# EAGLE design 8Pin_Fuse (EAGLE 9.6.2)
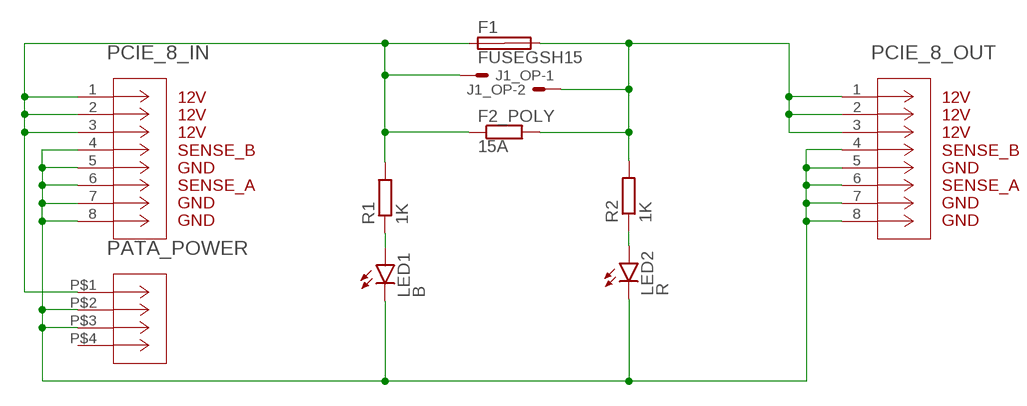
[diagram p0: schematic, sheet 1]

## Parts
F1  FUSEGSH15  SHK20Q  [SHK20Q]
F2_POLY  15A  R-EU_M1206  [M1206]
J1_OP  87758-0216  [87758-0216]
LED1  B  LEDSML0805  [SML0805]
LED2  R  LEDSML0805  [SML0805]
PATA_POWER  PATA_POWER  [PATA_POWER]
PCIE_8_IN  457180003A  [CON_457180003_MOL]
PCIE_8_OUT  457180003A  [CON_457180003_MOL]
R1  1K  R-EU_M0805  [M0805]
R2  1K  R-EU_M0805  [M0805]

## Nets
12V: F1.1A F2_POLY.1 J1_OP.1 PATA_POWER.P$1 PCIE_8_IN.1 PCIE_8_IN.2 PCIE_8_IN.3 R1.2
12VO [12V]: F1.2A F2_POLY.2 J1_OP.2 PCIE_8_OUT.1 PCIE_8_OUT.2 PCIE_8_OUT.3 R2.2
GND: LED1.C LED2.C PATA_POWER.P$2 PATA_POWER.P$3 PCIE_8_IN.4 PCIE_8_IN.5 PCIE_8_IN.6 PCIE_8_IN.7 PCIE_8_IN.8 PCIE_8_OUT.4 PCIE_8_OUT.5 PCIE_8_OUT.6 PCIE_8_OUT.7 PCIE_8_OUT.8
N$4 [12V]: LED2.A R2.1
N$5 [12V]: LED1.A R1.1
Unconnected: F1.1B F1.2B PATA_POWER.P$4

## Library data of the parts
F1 = fuse:SHK20Q: FUSE HOLDER 5 x 20 mm, SH contact, E1207 Buerklin 64G6061; OC_FARNELL: unknown; OC_NEWARK: unknown
F2_POLY R1 R2 = rcl:R-EU_: RESISTOR, European symbol; SPICEPREFIX: R
J1_OP = con-molex:87758-0216: 2 Pin - 2mm Dual Row Single Wafer, Vertical T/H HDR Source: http://www.molex.com/pdm_docs/sd/877580616_sd.pdf; MF: MOLEX; MPN: 87758-0216; OC_FARNELL: unknown; OC_NEWARK: 94M1513
LED1 LED2 = led:LED: LED OSRAM: - CHIPLED LG R971, LG N971, LY N971, LG Q971, LY Q971, LO R971, LY R971 LH N974, LH R974 LS Q976, LO Q976, LY Q976 LO Q996 - Hyper CHIPLED LW Q18S LB Q993, LB Q99A, LB R99A - SideLED LS A670, LO A670, LY A670, LG A670, LP A670 LB A673, LV A673, LT A673, LW A673 LH A674 LY A675 LS A676, LA A676, LO A676, LY A676, LW A676 LS A679, LY A679, LG A679 - Hyper Micro SIDELED® LS Y876, LA Y876, LO Y876, LY Y876 LT Y87S - SmartLED LW L88C, LW L88S LB L89C, LB L89S, LG L890 LS L89K, LO L89K, LY L89K LS L896, LA L896, LO L896, LY L896 - TOPLED LS T670, LO T670, LY T670, LG T670, LP T670 LSG T670, LSP T670, LSY T670, LOP T670, LYG T670 LG T671, LOG T671, LSG T671 LB T673, LV T673, LT T673, LW T673 LH T674 LS T676, LA T676, LO T676, LY T676, LB T676, LH T676, LSB T676, LW T676 LB T67C, LV T67C, LT T67C, LS T67K, LO T67K, LY T67K, LW E67C LS E67B, LA E67B, LO E67B, LY E67B, LB E67C, LV E67C, LT E67C LW T67C LS T679, LY T679, LG T679 LS T770, LO T770, LY T770, LG T770, LP T770 LB T773, LV T773, LT T773, LW T773 LH T774 LS E675, LA E675, LY E675, LS T675 LS T776, LA T776, LO T776, LY T776, LB T776 LHGB T686 LT T68C, LB T68C - Hyper Mini TOPLED® LB M676 - Mini TOPLED Santana® LG M470 LS M47K, LO M47K, LY M47K Source: http://www.osram.convergy.de LUXEON: - LUMILED® LXK2-PW12-R00, LXK2-PW12-S00, LXK2-PW14-U00, LXK2-PW14-V00 LXK2-PM12-R00, LXK2-PM12-S00, LXK2-PM14-U00 LXK2-PE12-Q00, LXK2-PE12-R00, LXK2-PE12-S00, LXK2-PE14-T00, LXK2-PE14-U00 LXK2-PB12-K00, LXK2-PB12-L00, LXK2-PB12-M00, LXK2-PB14-N00, LXK2-PB14-P00, LXK2-PB14-Q00 LXK2-PR12-L00, LXK2-PR12-M00, LXK2-PR14-Q00, LXK2-PR14-R00 LXK2-PD12-Q00, LXK2-PD12-R00, LXK2-PD12-S00 LXK2-PH12-R00, LXK2-PH12-S00 LXK2-PL12-P00, LXK2-PL12-Q00, LXK2-PL12-R00 Source: www.luxeon.com KINGBRIGHT: KA-3528ASYC Source: www.kingbright.com
PATA_POWER = PCIE_6_8Pin:PATA_POWER
PCIE_8_IN PCIE_8_OUT = PCIE_6_8Pin:457180003

## Net classes
2 GND: clearance 0.508 mm

## Board
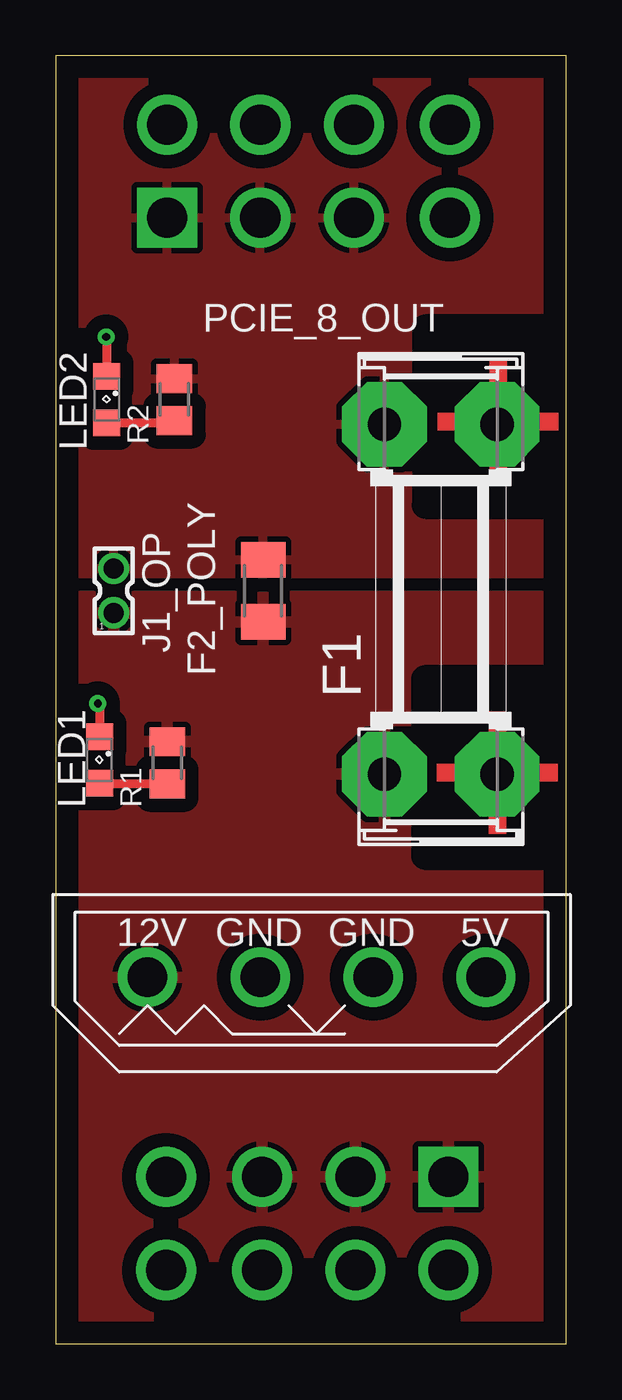
[diagram p1: board, top side]
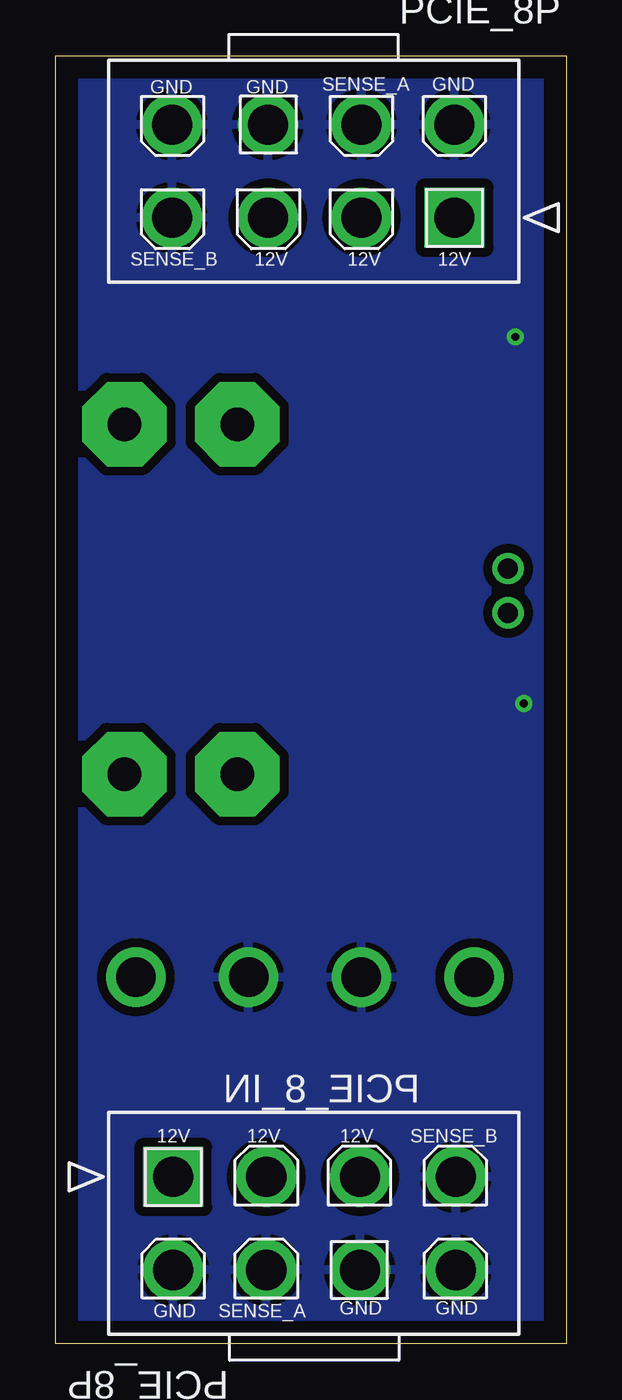
[diagram p2: board, bottom side, seen from below]

Size 23 x 58 mm. Coordinates in mm from the lower left corner, seen from the top.
Outline: 0,0 23,0 23,58 0,58 0,0
Copper layers (1*16): Top 0.035mm / dielectric 1.5mm / Bottom 0.035mm
Design rules "default": minimum track width 6mil, minimum drill 0.35mm, track to track 6mil, track to pad 6mil, pad to pad 6mil, via to via 6mil, smd to smd 6mil, copper to edge 40mil, drill to drill 6mil, minimum pad ring 10mil, minimum via ring 8mil, stop-mask expansion 4mil, vias tented up to drill 0mil, thermal gap 10mil

### Footprints (pad centres in the part's own frame; a part is rotated, then mirrored left to right if it is on the bottom)
SHK20Q = drill 1.5 pad 3.81 octagon: 1A -7.874,2.54; 1B -7.874,-2.54; 2A 7.874,2.54; 2B 7.874,-2.54
M1206 = smd 1.6 x 2: 1 -1.4,0; 2 1.4,0
87758-0216 = drill 0.9 pad 1.27: 1 0,-1; 2 0,1
SML0805 = smd 1.2 x 1.2: A 1.05,0; C -1.05,0
PATA_POWER = drill 1.78: P$1 1.27,1.27; P$2 6.35,1.27; P$3 11.43,1.27; P$4 16.51,1.27
CON_457180003_MOL = drill 1.803 pad 2.311 square: 1 0,0 | drill 1.803 pad 2.311: 2 -4.191,0; 3 -8.407,0; 4 -12.725,0; 5 0,4.191; 6 -4.191,4.191; 7 -8.407,4.191; 8 -12.725,4.191
M0805 = smd 1.3 x 1.6: 1 -0.95,0; 2 0.95,0

### Placement (x,y rotation side)
F1  17.35,33.53 90 top
F2_POLY  9.35,33.91 90 top
J1_OP  2.62,33.91 0 top
LED1  1.99,26.29 270 top
LED2  2.31,42.52 270 top
PATA_POWER  2.87,15.24 0 top
PCIE_8_IN  17.7,7.52 180 bottom
PCIE_8_OUT  5.03,50.7 0 bottom
R1  5.03,26.16 90 top
R2  5.35,42.52 90 top

### Tracks (layer width: path | path; a pad name or v marks a point on that pad's centre or on a via)
12V
  pour Top (isolate 0.61): 0,33.66 0,0 22.86,0 22.86,33.66
12VO
  pour Top (isolate 0.61): 0,34.67 22.86,34.67 22.86,58 0,58
GND  (via drill 0.35)
  Top 0.406: v1.91,28.83 1.99,28.75 LED1.C | v2.29,45.34 2.29,45.25 2.31,45.23 LED2.C
  pour Bottom (isolate 0.406): 0,58.04 22.86,58.04 22.86,0 0,0
N$4
  Top 0.406: LED2.A 5.35,41.47 R2.1
N$5
  Top 0.406: LED1.A 5.03,25.24 R1.1

### Text on the board
Top: + | +